# EAGLE schematic YOTSUBA_MC_ver.2.4 (EAGLE 9.6.2)
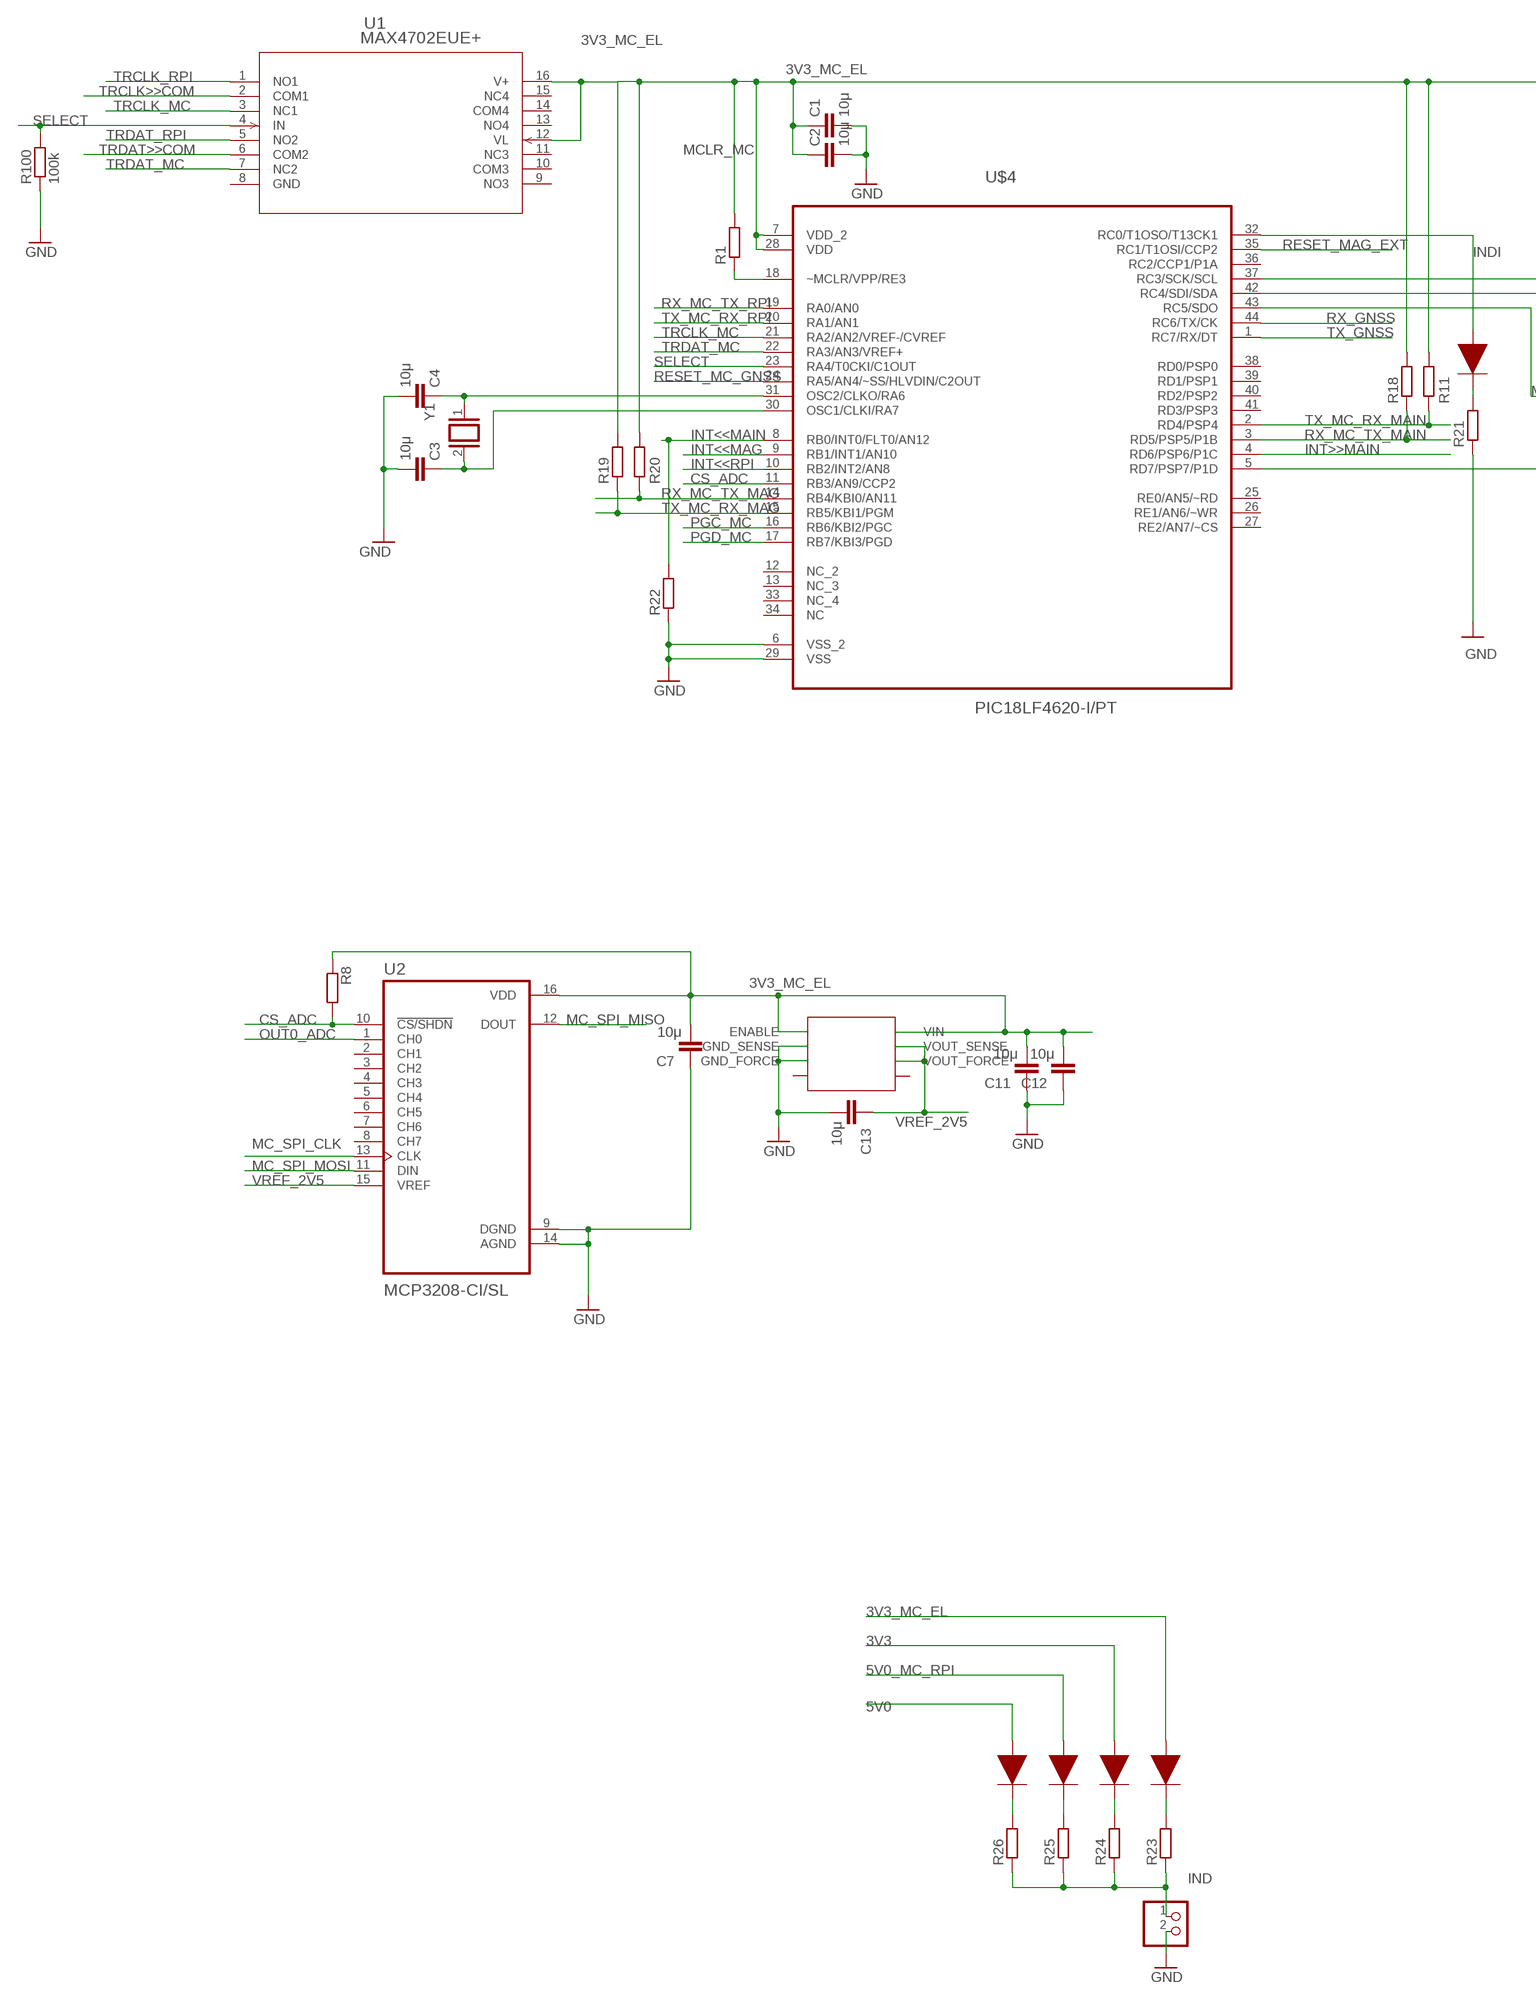
[diagram p0: schematic, sheet 1, part 1 of 2]
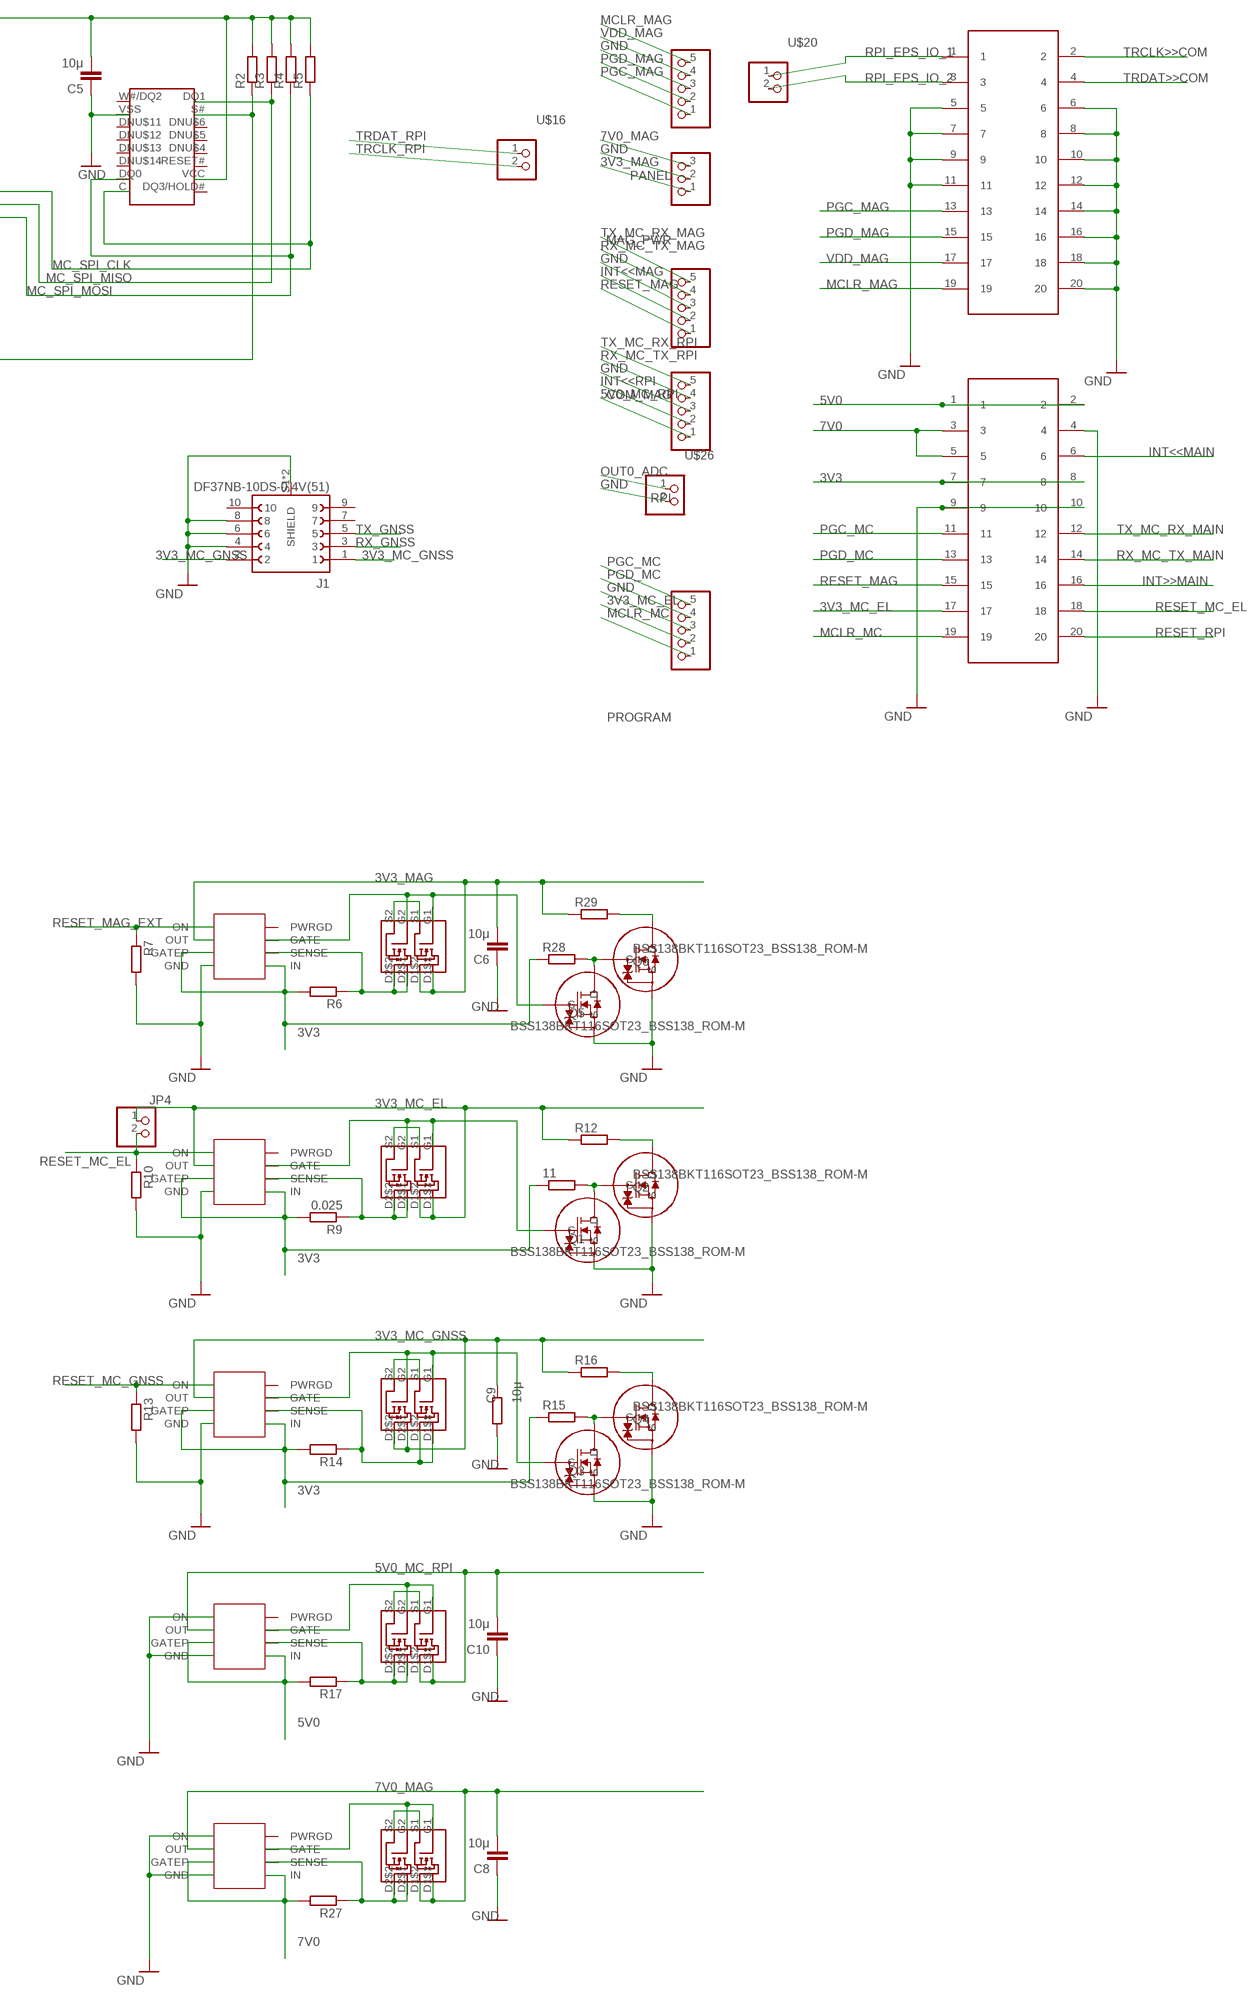
[diagram p1: schematic, sheet 1, part 2 of 2]

## Parts
11  R-EU_R2012  [R2012]
C1  10μ  C-EUC2012  [C2012]
C2  10μ  C-EUC2012  [C2012]
C3  10μ  C-EUC2012  [C2012]
C4  10μ  C-EUC2012  [C2012]
C5  10μ  C-EUC2012  [C2012]
C6  10μ  C-EUC2012  [C2012]
C7  10μ  C-EUC2012  [C2012]
C8  10μ  C-EUC2012  [C2012]
C9  10μ  R-EU_R2012  [R2012]
C10  10μ  C-EUC2012  [C2012]
C11  10μ  C-EUC2012  [C2012]
C12  10μ  C-EUC2012  [C2012]
C13  10μ  C-EUC2012  [C2012]
COM_MAG  PINHD-1X5  [1X05]
IND  PINHD-1X2  [1X02]
J1  DF37NB-10DS-0.4V(51)  [HRS_DF37NB-10DS-0.4V(51)]
JP4  PINHD-1X2  [1X02]
MAG_PWR  PINHD-1X3  [1X03]
PANEL  PINHD-1X5  [1X05]
PROGRAM  PINHD-1X5  [1X05]
Q1  BSS138BKT116SOT23_BSS138_ROM-M  [SOT23_BSS138_ROM-M]
Q2  BSS138BKT116SOT23_BSS138_ROM-M  [SOT23_BSS138_ROM-M]
Q3  BSS138BKT116SOT23_BSS138_ROM-M  [SOT23_BSS138_ROM-M]
Q4  BSS138BKT116SOT23_BSS138_ROM-M  [SOT23_BSS138_ROM-M]
Q5  BSS138BKT116SOT23_BSS138_ROM-M  [SOT23_BSS138_ROM-M]
Q6  BSS138BKT116SOT23_BSS138_ROM-M  [SOT23_BSS138_ROM-M]
R1  R-EU_R2012  [R2012]
R2  R-EU_R2012  [R2012]
R3  R-EU_R2012  [R2012]
R4  R-EU_R2012  [R2012]
R5  R-EU_R2012  [R2012]
R6  R-EU_R2012  [R2012]
R7  R-EU_R2012  [R2012]
R8  R-EU_R2012  [R2012]
R9  0.025  R-EU_R2012  [R2012]
R10  R-EU_R2012  [R2012]
R11  R-EU_R2012  [R2012]
R12  R-EU_R2012  [R2012]
R13  R-EU_R2012  [R2012]
R14  R-EU_R2012  [R2012]
R15  R-EU_R2012  [R2012]
R16  R-EU_R2012  [R2012]
R17  R-EU_R2012  [R2012]
R18  R-EU_R2012  [R2012]
R19  R-EU_R2012  [R2012]
R20  R-EU_R2012  [R2012]
R21  R-EU_R2012  [R2012]
R22  R-EU_R2012  [R2012]
R23  R-EU_R2012  [R2012]
R24  R-EU_R2012  [R2012]
R25  R-EU_R2012  [R2012]
R26  R-EU_R2012  [R2012]
R27  R-EU_R2012  [R2012]
R28  R-EU_R2012  [R2012]
R29  R-EU_R2012  [R2012]
R100  100k  R-EU_R2012  [R2012]
RPI  PINHD-1X5  [1X05]
U1  MAX4702EUE+  [21-0066J_16]
U2  MCP3208-CI/SL  [SOIC127P600X175-16N]
U$1  MT25QL512_16SOP2  [SOIC127P1032X265-16N]
U$2  DMG6898LSD  [SOIC127P600X150-8N]
U$3  LTC4361  [SOP65P280X100-8N]
U$4  PIC18LF4620-I/PT  [QFP80P1200X1200X120-44N]
U$7  DMG6898LSD  [SOIC127P600X150-8N]
U$8  LTC4361  [SOP65P280X100-8N]
U$9  DMG6898LSD  [SOIC127P600X150-8N]
U$10  DMG6898LSD  [SOIC127P600X150-8N]
U$11  LTC4361  [SOP65P280X100-8N]
U$12  LTC4361  [SOP65P280X100-8N]
U$13  DMG6898LSD  [SOIC127P600X150-8N]
U$14  LTC4361  [SOP65P280X100-8N]
U$16  PINHD-1X2  [1X02]
U$17  M50-3001045  [M50-3001045]
U$18  LED_1608  [LED_1608]
U$19  ADR35XX  [SOP65P490X110-8N]
U$20  PINHD-1X2  [1X02]
U$21  LED_1608  [LED_1608]
U$22  M50-3001045  [M50-3001045]
U$23  LED_1608  [LED_1608]
U$24  LED_1608  [LED_1608]
U$25  LED_1608  [LED_1608]
U$26  PINHD-1X2  [1X02]
Y1  HC-49/U-S16000000ABJB  [XTAL_HC49P488W43L1150T466H350]

## Nets
3V3 [POWER]: 11.1 R6.2 R9.2 R14.2 R15.1 R28.1 U$3.GATEP U$3.IN U$8.GATEP U$8.IN U$11.GATEP U$11.IN U$17.7 U$17.8 U$23.A
3V3_MAG [POWER]: C6.2 MAG_PWR.1 R29.1 U$2.D1$1 U$2.D1$2 U$3.OUT
3V3_MC_EL [POWER]: C1.1 C2.1 C5.2 C7.2 C11.2 C12.2 JP4.1 PROGRAM.2 R1.2 R2.2 R3.2 R4.2 R5.2 R8.1 R11.2 R12.1 R18.2 R19.2 R20.2 U1.12(VL) U1.16(V+) U2.16(VDD) U$1.VCC U$4.7(VDD_2) U$4.28(VDD) U$7.D1$1 U$7.D1$2 U$8.OUT U$17.17 U$19.ENABLE U$19.VIN U$21.A
3V3_MC_GNSS [POWER]: C9.2 J1.1 J1.2 R16.1 U$10.D2$1 U$10.D2$2 U$11.OUT
5V0 [POWER]: R17.2 U$14.GATEP U$14.IN U$17.1 U$17.2 U$25.A
5V0_MC_RPI [POWER]: C10.2 RPI.1 U$13.D1$1 U$13.D1$2 U$14.OUT U$24.A
7V0 [POWER]: R27.2 U$12.GATEP U$12.IN U$17.3 U$17.5
7V0_MAG [POWER]: C8.2 MAG_PWR.3 U$9.D1$1 U$9.D1$2 U$12.OUT
CS_ADC: R8.2 U2.10(!CS/SHDN) U$4.11(RB3/AN9/CCP2)
GND [gnd]: C1.2 C2.2 C3.2 C4.2 C5.1 C6.1 C7.1 C8.1 C9.1 C10.1 C11.1 C12.1 C13.2 COM_MAG.3 IND.2 J1.4 J1.6 J1.8 J1.S1(SHIELD) J1.S2(SHIELD) MAG_PWR.2 PANEL.3 PROGRAM.3 Q1.1(S) Q2.1(S) Q3.1(S) Q4.1(S) Q5.1(S) Q6.1(S) R7.2 R10.2 R13.2 R21.1 R22.1 R100.1 RPI.3 U2.9(DGND) U2.14(AGND) U$1.VSS U$3.GND U$4.6(VSS_2) U$4.29(VSS) U$8.GND U$11.GND U$12.GND U$12.ON U$14.GND U$14.ON U$17.4 U$17.9 U$17.10 U$19.GND_FORCE U$19.GND_SENSE U$22.5 U$22.6 U$22.7 U$22.8 U$22.9 U$22.10 U$22.11 U$22.12 U$22.14 U$22.16 U$22.18 U$22.20 U$26.2
INDI: U$4.32(RC0/T1OSO/T13CK1) U$18.A
INT<<MAG: COM_MAG.2 U$4.9(RB1/INT1/AN10)
INT<<MAIN: R22.2 U$4.8(RB0/INT0/FLT0/AN12) U$17.6
INT<<RPI: RPI.2 U$4.10(RB2/INT2/AN8)
INT>>MAIN: U$4.4(RD6/PSP6/P1C) U$17.16
MC_SPI_CLK: R5.1 U2.13(CLK) U$1.C U$4.37(RC3/SCK/SCL)
MC_SPI_MISO: R3.1 U2.12(DOUT) U$1.DQ1 U$4.42(RC4/SDI/SDA)
MC_SPI_MOSI: R4.1 U2.11(DIN) U$1.DQ0 U$4.43(RC5/SDO)
MCLR_MAG: PANEL.5 U$22.19
MCLR_MC: PROGRAM.1 R1.1 U$4.18(~MCLR/VPP/RE3) U$17.19
N$2: R23.2 U$21.C
N$3: C3.1 U$4.30(OSC1/CLKI/RA7) Y1.2
N$4: R24.2 U$23.C
N$5: C4.1 U$4.31(OSC2/CLKO/RA6) Y1.1
N$6: R25.2 U$24.C
N$7: R26.2 U$25.C
N$8: R2.1 U$1.S# U$4.5(RD7/PSP7/P1D)
N$9: IND.1 R23.1 R24.1 R25.1 R26.1
N$10: U$2.S1 U$2.S2
N$11: R6.1 U$2.D2$1 U$2.D2$2 U$3.SENSE
N$12: Q5.2(G) U$2.G1 U$2.G2 U$3.GATE
N$13: Q5.3(D) Q6.2(G) R28.2
N$14: U$9.S1 U$9.S2
N$15: R21.2 U$18.C
N$16: R27.1 U$9.D2$1 U$9.D2$2 U$12.SENSE
N$17: U$9.G1 U$9.G2 U$12.GATE
N$18: Q6.3(D) R29.2
N$19: U$7.S1 U$7.S2
N$20: R9.1 U$7.D2$1 U$7.D2$2 U$8.SENSE
N$22: Q1.2(G) U$7.G1 U$7.G2 U$8.GATE
N$24: 11.2 Q1.3(D) Q2.2(G)
N$26: Q2.3(D) R12.2
N$28: U$10.S1 U$10.S2
N$29: R14.1 U$10.D1$1 U$10.D1$2 U$11.SENSE
N$30: Q3.2(G) U$10.G1 U$10.G2 U$11.GATE
N$33: Q3.3(D) Q4.2(G) R15.2
N$34: Q4.3(D) R16.2
N$36: U$13.S1 U$13.S2
N$37: R17.1 U$13.D2$1 U$13.D2$2 U$14.SENSE
N$38: U$13.G1 U$13.G2 U$14.GATE
OUT0_ADC: U2.1(CH0) U$26.1
PGC_MAG: PANEL.1 U$22.13
PGC_MC: PROGRAM.5 U$4.16(RB6/KBI2/PGC) U$17.11
PGD_MAG: PANEL.2 U$22.15
PGD_MC: PROGRAM.4 U$4.17(RB7/KBI3/PGD) U$17.13
RESET_MAG: COM_MAG.1 U$17.15
RESET_MAG_EXT: R7.1 U$3.ON U$4.35(RC1/T1OSI/CCP2)
RESET_MC_EL: JP4.2 R10.1 U$8.ON U$17.18
RESET_MC_GNSS: R13.1 U$4.24(RA5/AN4/~SS/HLVDIN/C2OUT) U$11.ON
RESET_RPI: U$17.20
RPI_EPS_IO_1: U$20.1 U$22.1
RPI_EPS_IO_2: U$20.2 U$22.3
RX_GNSS: J1.3 U$4.44(RC6/TX/CK)
RX_MC_TX_MAG: COM_MAG.4 R20.1 U$4.14(RB4/KBI0/AN11)
RX_MC_TX_MAIN: R18.1 U$4.3(RD5/PSP5/P1B) U$17.14
RX_MC_TX_RPI: RPI.4 U$4.19(RA0/AN0)
SELECT: R100.2 U1.4(IN) U$4.23(RA4/T0CKI/C1OUT)
TRCLK>>COM: U1.2(COM1) U$22.2
TRCLK_MC: U1.3(NC1) U$4.21(RA2/AN2/VREF-/CVREF)
TRCLK_RPI: U1.1(NO1) U$16.1
TRDAT>>COM: U1.6(COM2) U$22.4
TRDAT_MC: U1.7(NC2) U$4.22(RA3/AN3/VREF+)
TRDAT_RPI: U1.5(NO2) U$16.2
TX_GNSS: J1.5 U$4.1(RC7/RX/DT)
TX_MC_RX_MAG: COM_MAG.5 R19.1 U$4.15(RB5/KBI1/PGM)
TX_MC_RX_MAIN: R11.1 U$4.2(RD4/PSP4) U$17.12
TX_MC_RX_RPI: RPI.5 U$4.20(RA1/AN1)
VDD_MAG: PANEL.4 U$22.17
VREF_2V5: C13.1 U2.15(VREF) U$19.VOUT_FORCE U$19.VOUT_SENSE
Unconnected: J1.7 J1.9 J1.10 U1.9(NO3) U1.10(COM3) U1.11(NC3) U1.13(NO4) U1.14(COM4) U1.15(NC4) U2.2(CH1) U2.3(CH2) U2.4(CH3) U2.5(CH4) U2.6(CH5) U2.7(CH6) U2.8(CH7) U$1.DNU$4 U$1.DNU$5 U$1.DNU$6 U$1.DNU$11 U$1.DNU$12 U$1.DNU$13 U$1.DNU$14 U$1.DQ3/HOLD# U$1.RESET# U$1.W#/DQ2 U$3.PWRGD U$4.12(NC_2) U$4.13(NC_3) U$4.25(RE0/AN5/~RD) U$4.26(RE1/AN6/~WR) U$4.27(RE2/AN7/~CS) U$4.33(NC_4) U$4.34(NC) U$4.36(RC2/CCP1/P1A) U$4.38(RD0/PSP0) U$4.39(RD1/PSP1) U$4.40(RD2/PSP2) U$4.41(RD3/PSP3) U$8.PWRGD U$11.PWRGD U$12.PWRGD U$14.PWRGD U$19.NIC@1(NIC) U$19.NIC@2(NIC)

## Power pins joined to a net without a drawn wire
GND: U1.8(GND)

## Library data of the parts
11 C9 R1-R29 R100 = rcl:R-EU_: RESISTOR, European symbol; SPICEPREFIX: R
C1-C8 C10-C13 = rcl:C-EU: CAPACITOR, European symbol; SPICEPREFIX: C
COM_MAG PANEL PROGRAM RPI = pinhead:PINHD-1X5: PIN HEADER
IND JP4 U$16 U$20 U$26 = pinhead:PINHD-1X2: PIN HEADER
J1 = DF37NB-10DS-0.4V_51_:DF37NB-10DS-0.4V(51): Check availability <https://pricing.snapeda.com/parts/DF37NB-10DS-0.4V%2851%29/Hirose/view-part?ref=eda>; AVAILABILITY: In Stock; DESCRIPTION: 10 Position Connector Receptacle, Center Strip Contacts Surface Mount Gold; MF: Hirose; MP: DF37NB-10DS-0.4V(51); PACKAGE: None; PRICE: None; PURCHASE-URL: https://pricing.snapeda.com/search?q=DF37NB-10DS-0.4V(51)&ref=eda
MAG_PWR = pinhead:PINHD-1X3: PIN HEADER
Q1-Q6 = BSS138BKT:BSS138BKT116; COPYRIGHT: Copyright (C) 2023 Ultra Librarian. All rights reserved.; DIGIKEY_PART_NUMBER_1: 846-BSS138BKT116TR-ND; DIGIKEY_PART_NUMBER_2: 846-BSS138BKT116CT-ND; DIGIKEY_PART_NUMBER_3: 846-BSS138BKT116DKR-ND; MANUFACTURER_PART_NUMBER: BSS138BKT116; MFR_NAME: ROHM Semiconductor
U1 = MAX4702:MAX4702EUE+; COPYRIGHT: Copyright (C) 2022 Ultra Librarian. All rights reserved.; MANUFACTURER_PART_NUMBER: MAX4702EUE+; MFR_NAME: Analog Devices Inc
U2 = MCP3208-CI_SL:MCP3208-CI/SL: Check availability <https://pricing.snapeda.com/parts/MCP3208-CI/SL/Microchip%20Technology/view-part?ref=eda>; AVAILABILITY: In Stock; DESCRIPTION: 12 Bit Analog to Digital Converter 4, 8 Input 1 SAR 16-SOIC; MF: Microchip Technology; MP: MCP3208-CI/SL; PACKAGE: SOIC-16 Microchip; PRICE: None; PURCHASE-URL: https://pricing.snapeda.com/search?q=MCP3208-CI/SL&ref=eda
U$1 = MT25QL512_8:MT25QL512_16SOP2
U$2 U$7 U$9 U$10 U$13 = DMG6898LSD:DMG6898LSD
U$3 U$8 U$11 U$12 U$14 = ltc4361:LTC4361
U$4 = PIC18LF4620-I_PT:PIC18LF4620-I/PT: Flash Microcontrollers Check availability <https://pricing.snapeda.com/parts/PIC18LF4620-I/PT/Microchip/view-part?ref=eda>; AVAILABILITY: In Stock; DESCRIPTION: PIC PIC® 18F Microcontroller IC 8-Bit 40MHz 64KB (32K x 16) FLASH 44-TQFP (10x10); MF: Microchip; MP: PIC18LF4620-I/PT; PACKAGE: TQFP-44 Microchip; PRICE: None; PURCHASE-URL: https://pricing.snapeda.com/search?q=PIC18LF4620-I/PT&ref=eda
U$17 U$22 = MITSUBA_Connectors-v4.0:M50-3001045: 20pins 1.27mm pitch 2line pinsocket
U$18 U$21 U$23-U$25 = LED_1608:LED_1608
U$19 = adr35xx:ADR35XX
Y1 = HC-49_U-S16000000ABJB:HC-49/U-S16000000ABJB: HC49US Series 16 MHz ±30 ppm 18 pF -20 to +70 °C Through Hole AT-CUT Crystal; DESCRIPTION: 16 MHz ±30ppm Crystal 18pF 50 Ohms HC-49/US; DIGI-KEY_PART_NUMBER: 300-6034-ND; MF: Citizen Finedevice Co Ltd; MP: HC-49/U-S16000000ABJB; PACKAGE: HC-49/US Citizen Finetech Miyota; PURCHASE-URL: https://pricing.snapeda.com/search?q=HC-49/U-S16000000ABJB&ref=eda

## Net classes
0 default: clearance 0.178 mm
1 ant: clearance 0.559 mm
2 gnd: clearance 0.508 mm
3 POWER: width 0.305 mm, clearance 0.254 mm